# Altium schematic sheet M4F_MCU.SchDoc: M4F_MCU
size Letter; DrawnBy: D. Fusi; DocumentNumber: 1; Revision: DVT; SheetNumber: 1; SheetTotal: 7
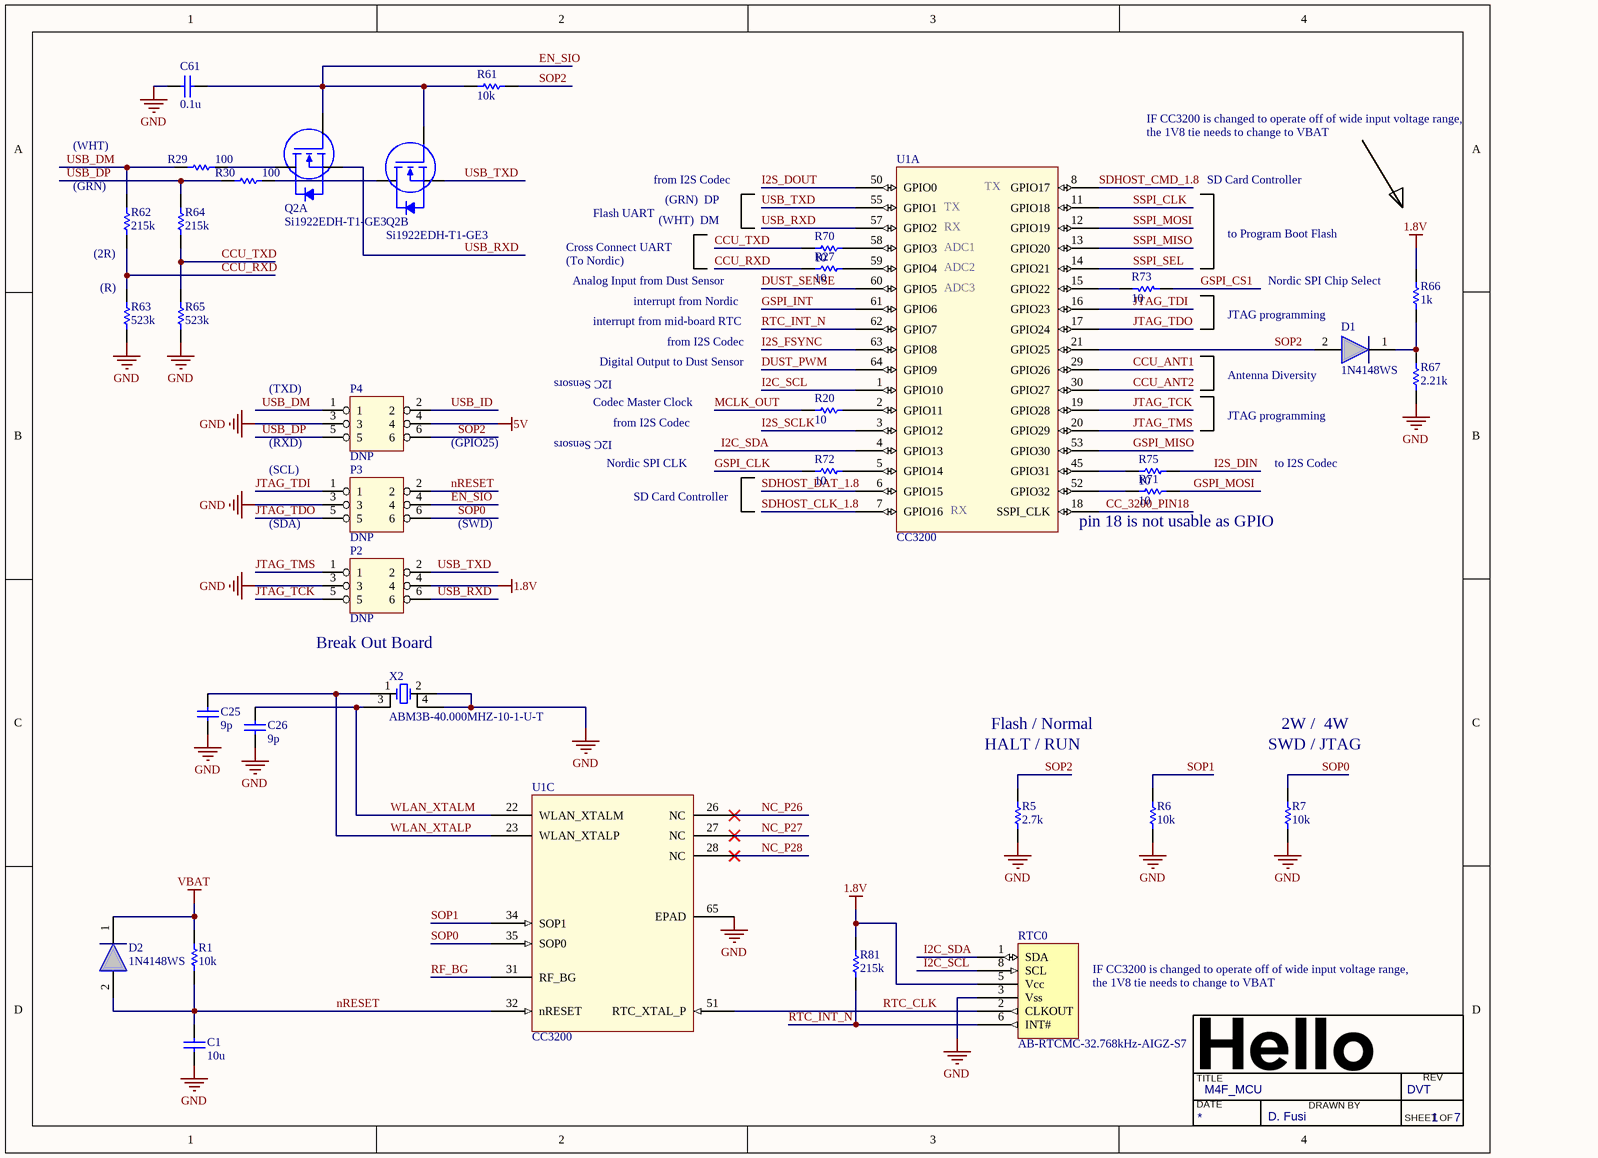
[diagram p0: M4F_MCU.SchDoc]

## Parts
C1  10u  [CAP0603_SENSE_DVT]
C25  9p  [CAP0402_SENSE_DVT]
C26  9p  [CAP0402_SENSE_DVT]
C61  0.1u  [CAP0603_SENSE_DVT]
D1  1N4148WS  [SOD-323]
D2  1N4148WS  [SOD-323]
P2  DNP  [HDR2.00-2X3-SMD]
P3  DNP  [HDR2.00-2X3-SMD]
P4  DNP  [HDR2.00-2X3-SMD]
Q2  Si1922EDH-T1-GE3  [SC-70-6]  (parts A,B of 2)
R1  10k  [RES0402_SENSE_DVT]
R5  2.7k  [RES0402_SENSE_DVT]
R6  10k  [RES0402_SENSE_DVT]
R7  10k  [RES0402_SENSE_DVT]
R20  10  [RES0402_SENSE_DVT]
R27  10  [RES0402_SENSE_DVT]
R29  100  [RES0402_SENSE_DVT]
R30  100  [RES0402_SENSE_DVT]
R61  10k  [RES0402_SENSE_DVT]
R62  215k  [RES0402_SENSE_DVT]
R63  523k  [RES0402_SENSE_DVT]
R64  215k  [RES0402_SENSE_DVT]
R65  523k  [RES0402_SENSE_DVT]
R66  1k  [RES0402_SENSE_DVT]
R67  2.21k  [RES0402]
R70  10  [RES0402_SENSE_DVT]
R71  10  [RES0402_SENSE_DVT]
R72  10  [RES0402_SENSE_DVT]
R73  10  [RES0402_SENSE_DVT]
R75  10  [RES0402_SENSE_DVT]
R81  215k  [RES0402_SENSE_DVT]
RTC0  AB-RTCMC-32.768kHz-AIGZ-S7  [8-CLCC]
U1  CC3200  [QFN50P900X900X100_HS-65N]  (parts A,C of 3)
X2  ABM3B-40.000MHZ-10-1-U-T  [ABM3B_CRYSTAL]

## Nets
1.8V: P2.4 R66.2 R81.2 RTC0.5(Vcc)
5V: P4.4
GND: C1.1 C25.1 C26.1 C61.2 P2.3 P3.3 P4.3 R5.1 R6.1 R7.1 R63.1 R65.1 R67.1 RTC0.3(Vss) U1.65(EPAD) X2.2 X2.4
VBAT: D2.1(Cathode) R1.2
CC_3200_PIN18: U1.18(SSPI_CLK)
CCU_ANT1: U1.29(GPIO26)
CCU_ANT2: U1.30(GPIO27)
CCU_RXD: R27.2 R62.1 R63.2
CCU_TXD: R64.1 R65.2 R70.2
DUST_PWM: U1.64(GPIO9)
DUST_SENSE: U1.60(GPIO5)
EN_SIO: C61.1 P3.4 Q2.2(G1) Q2.5(G2) R61.2
GSPI_CLK: R72.2
GSPI_CS1: R73.2
GSPI_INT: U1.61(GPIO6)
GSPI_MISO: U1.53(GPIO30)
GSPI_MOSI: R71.1
I2C_SCL: RTC0.8(SCL) U1.1(GPIO10)
I2C_SDA: RTC0.1(SDA) U1.4(GPIO13)
I2S_DIN: R75.1
I2S_DOUT: U1.50(GPIO0)
I2S_FSYNC: U1.63(GPIO8)
I2S_SCLK: U1.3(GPIO12)
JTAG_TCK: P2.5 U1.19(GPIO28)
JTAG_TDI: P3.1 U1.16(GPIO23)
JTAG_TDO: P3.5 U1.17(GPIO24)
JTAG_TMS: P2.1 U1.20(GPIO29)
MCLK_OUT: R20.2
NC_P26: U1.26(NC)
NC_P27: U1.27(NC)
NC_P28: U1.28(NC)
nRESET: C1.2 D2.2(Anode) P3.2 R1.1 U1.32(nRESET)
RF_BG: U1.31(RF_BG)
RTC_CLK: RTC0.2(CLKOUT) U1.51(RTC_XTAL_P)
RTC_INT_N: R81.1 RTC0.6(INT#) U1.62(GPIO7)
SDHOST_CLK_1.8: U1.7(GPIO16)
SDHOST_CMD_1.8: U1.8(GPIO17)
SDHOST_DAT_1.8: U1.6(GPIO15)
SOP0: P3.6 R7.2 U1.35(SOP0)
SOP1: R6.2 U1.34(SOP1)
SOP2: D1.2(Anode) P4.6 R5.2 R61.1 U1.21(GPIO25)
SSPI_CLK: U1.11(GPIO18)
SSPI_MISO: U1.13(GPIO20)
SSPI_MOSI: U1.12(GPIO19)
SSPI_SEL: U1.14(GPIO21)
USB_DM: P4.1 R29.1 R62.2
USB_DP: P4.5 R30.1 R64.2
USB_ID: P4.2
USB_RXD: P2.6 Q2.1(S1) U1.57(GPIO2)
USB_TXD: P2.2 Q2.4(S2) U1.55(GPIO1)
WLAN_XTALM: C26.2 U1.22(WLAN_XTALM) X2.3
WLAN_XTALP: C25.2 U1.23(WLAN_XTALP) X2.1
NetD1_1: D1.1(Cathode) R66.1 R67.2
NetQ2_3: Q2.3(D2) R30.2
NetQ2_6: Q2.6(D1) R29.2
NetR20_1: R20.1 U1.2(GPIO11)
NetR27_1: R27.1 U1.59(GPIO4)
NetR70_1: R70.1 U1.58(GPIO3)
NetR71_2: R71.2 U1.52(GPIO32)
NetR72_1: R72.1 U1.5(GPIO14)
NetR73_1: R73.1 U1.15(GPIO22)
NetR75_2: R75.2 U1.45(GPIO31)

Not connected (* = marked no-connect by the designer): RTC0 4(NC) 7(NC)

## Notes on the sheet
- (WHT)
- IF CC3200 is changed to operate off of wide input voltage range,
- the 1V8 tie needs to change to VBAT
- (near R62) (GRN)
- Flash UART
- from I2S Codec
- (WHT)  DM
- (GRN)  DP
- (near U1) RX
- (near U1) TX
- SD Card Controller
- to Program Boot Flash
- (near R62) (2R)
- (near R63) (R)
- Cross Connect UART
- (To Nordic)
- Analog Input from Dust Sensor
- (near U1) ADC1
- (near U1) ADC2
- (near U1) ADC3
- (near R66) Nordic SPI Chip Select
- interrupt from mid-board RTC
- Digital Output to Dust Sensor
- I2C Sensors
- interrupt from Nordic
- (near D1) JTAG programming
- (near P4) (TXD)
- Codec Master Clock
- JTAG programming
- (near D1) Antenna Diversity
- (SCL)
- (RXD)
- (GPIO25)
- Nordic SPI CLK
- to I2S Codec
- (SDA)
- (SWD)
- pin 18 is not usable as GPIO
- Break Out Board
- (near R5) HALT / RUN
- Flash / Normal
- (near R7) SWD / JTAG
- 2W /  4W
- TITLE
- DATE
- DRAWN BY
- REV
- SHEET
- OF

## Library data of the parts
C1 = C_10u_10_6.3_X5R_0603: Chip capacitor; Vendor: TDK; PN: C1608X5R0J106K080AB; Tolerance: 10%; Voltage: 6.3V; Temp: X5R; Hello_PN: 225-00415; Value: 10u; Size: 0603; item_category: Capacitor
C25 C26 = C_9p_0.1_50_C0G_0402: Chip capacitor; Vendor: Murata; PN: GRM1555C1H9R1BA01D; Tolerance: 0.1; Voltage: 50V; Temp: C0G; Hello_PN: 225-00371; Value: 9p; Size: 0402; item_category: Capacitor
C61 = C_0.1u_20_16_X7R_0603: Chip capacitor; Vendor: Samsung; PN: CL10B104MO8NNNC; Tolerance: 20%; Voltage: 16V; Temp: X7R; Hello_PN: 225-00235; Value: 0.1u; Size: 0603
D1 D2 = 1N4148WS: Standard diode, 75V 150mA; Vendor: Fairchild; Hello_PN: 235-00318; PN: 1N4148WS; item_category: Diode
P2-P4 = HDR2.00-2X3-SMD: BOB headers
Q2 = Si1922EDH-T1-GE3: Vishay Dual N-Channel MOSFET Si1922EDH-T1-GE3; Hello_PN: 240-00392; item_category: Transistor; PN: Si1922EDH-T1-GE3; Vendor: Vishay
R1 R6 R7 R61 = R_10k_5_0.1_0402: Chip Resistor; Vendor: Panasonic; Tolerance: 5 %; Power: 0.1 W; PN: ERJ-2GEJ103X; Hello_PN: 220-00409; Model: *; Value: 10k; Size: 0402; item_category: Resistor
R5 = R_2.7k_5_0.1_0402: Chip Resistor; Vendor: Panasonic; Tolerance: 5 %; Power: 0.1 W; PN: ERJ-2GEJ272X; Hello_PN: 220-00248; Model: *; Value: 2.7k; Size: 0402
R20 R27 R70-R73 R75 = R_10_1_0.1_0402: Chip Resistor; Vendor: Panasonic; Tolerance: 1 %; Power: 0.1 W; PN: ERJ-2RKF10R0X; Hello_PN: 220-00405; Model: *; Value: 10; Size: 0402; item_category: Resistor
R29 R30 = R_100_1_0.1_0402: Chip Resistor; Vendor: Panasonic; Tolerance: 1 %; Power: 0.1 W; PN: ERJ-2RKF1000X; Hello_PN: 220-00404; Model: *; Value: 100; Size: 0402; item_category: Resistor
R62 R64 R81 = R_215k_1_0.1_0402: Chip Resistor; Vendor: Panasonic; Tolerance: 1 %; Power: 0.1 W; PN: ERJ-2RKF2153X; Hello_PN: 220-00301; Model: *; Value: 215k; Size: 0402; item_category: Resistor
R63 R65 = R_523k_1_0.1_0402: Chip Resistor; Vendor: Panasonic; Tolerance: 1 %; Power: 0.1 W; PN: ERJ-2RKF5233X; Hello_PN: 220-00165; Model: *; Value: 523k; Size: 0402; item_category: Resistor
R66 = R_1k_1_0.1_0402: Chip Resistor; Vendor: Panasonic; Tolerance: 1 %; Power: 0.1 W; PN: ERJ-2RKF1001X; Hello_PN: 220-00402; Model: *; Value: 1k; Size: 0402; item_category: Resistor
R67 = R_2.21k_1_0.1_0402_1: Chip Resistor; Vendor: Panasonic; Tolerance: 1 %; Power: 0.1 W; PN: ERJ-2RKF2211X; Hello_PN: 220-00410; Model: *; Value: 2.21k; Size: 0402; item_category: Resistor
RTC0 = AB-RTCMC-32.768kHz-AIGZ-S7: Abracon I2C RTC w/ integrated XO; Hello_PN: 250-00147; item_category: Oscillator/Crystal; PN: AB-RTCMC-32.768kHz-AIGZ-S7; Vendor: Abracon
U1 = CC3200: TI Wi-FI module; Hello_PN: 265-00252; item_category: IC Mixed Signal; Vendor: TI; PN: CC3200
X2 = Crystal_40M_50_50_18_50: Abracon 40 MHz crystal; Hello_PN: 250-00240; item_category: Oscillator/Crystal; PN: ABM3B-40.000MHZ-10-1-U-T; Vendor: Abracon